# Altium schematic sheet mcu.SchDoc
size A3
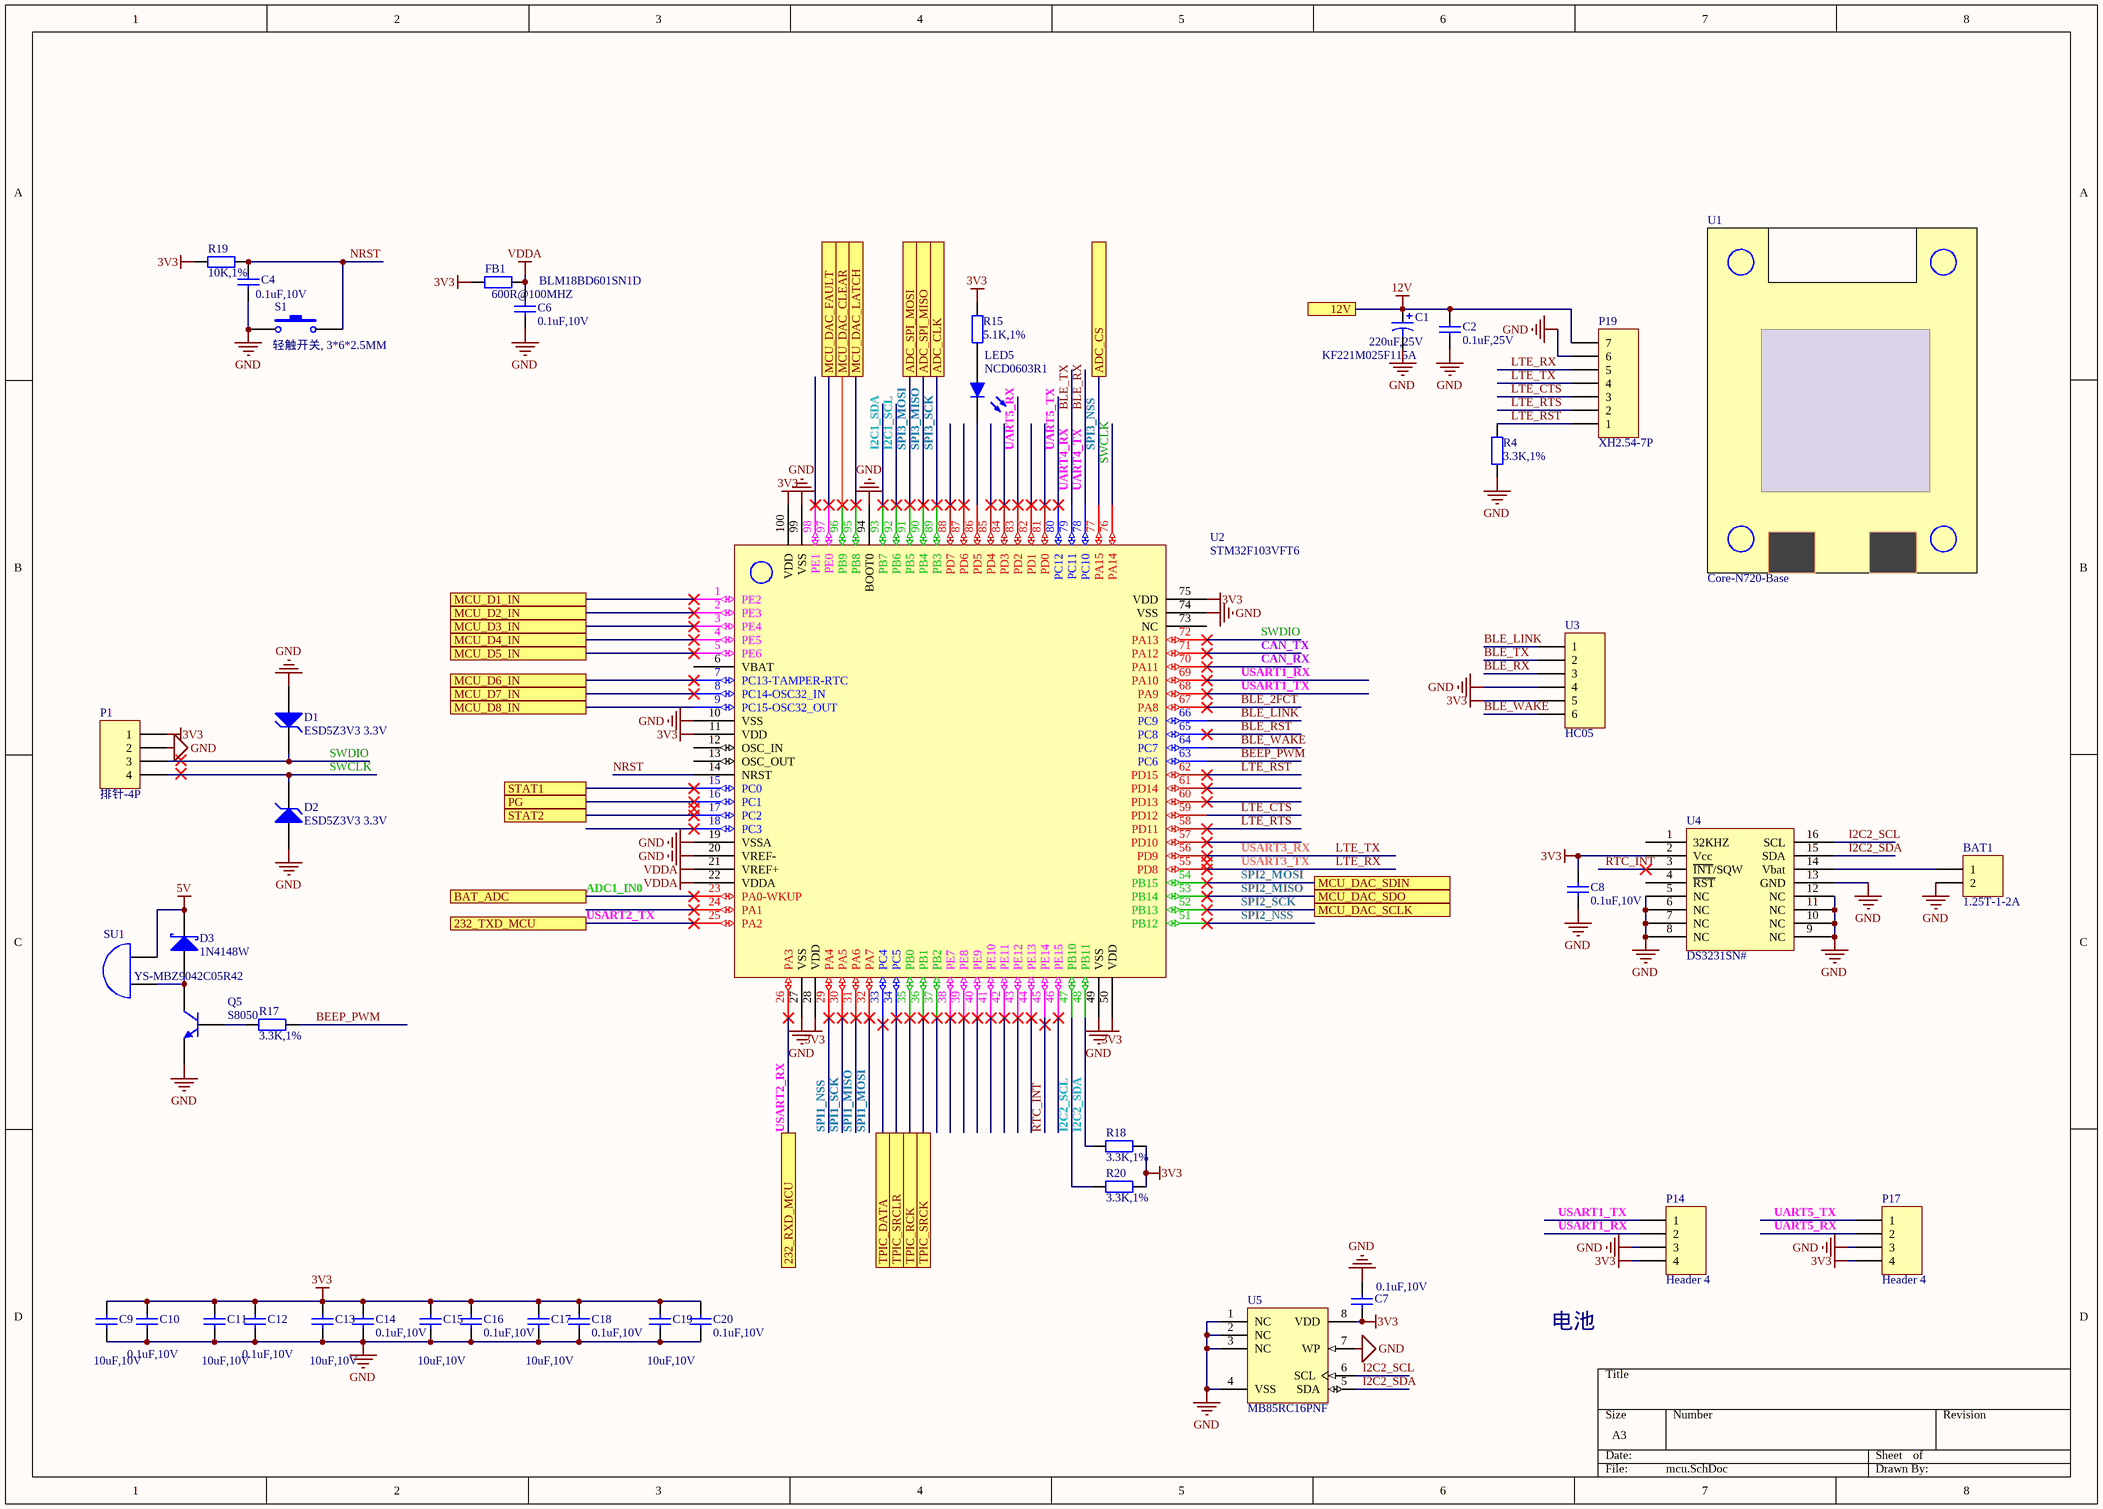
[diagram p0: mcu.SchDoc]

## Parts
BAT1  1.25T-1-2A  [1.25T-1-2A]
C1  220uF,25V  value KF221M025F115A  [CAP-TH_BD8.0-P3.50-D1.0-FD]
C2  0.1uF,25V  [C0603]
C4  0.1uF,10V  [C0603]
C6  0.1uF,10V  [C0603]
C7  0.1uF,10V  [C0603]
C8  0.1uF,10V  [C0603]
C9  10uF,10V  [C0603]
C10  0.1uF,10V  [C0603]
C11  10uF,10V  [C0603]
C12  0.1uF,10V  [C0603]
C13  10uF,10V  [C0603]
C14  0.1uF,10V  [C0603]
C15  10uF,10V  [C0603]
C16  0.1uF,10V  [C0603]
C17  10uF,10V  [C0603]
C18  0.1uF,10V  [C0603]
C19  10uF,10V  [C0603]
C20  0.1uF,10V  [C0603]
D1  ESD5Z3V3 3.3V  [SOD-523]
D2  ESD5Z3V3 3.3V  [SOD-523]
D3  1N4148W  [SOD-123_L2.8-W1.8-LS3.7-RD]
FB1  600R@100MHZ  value BLM18BD601SN1D  [L0603]
LED5  NCD0603R1  [LED0603-RD]
P1  排针-4P  [HDR1X4]
P14  Header 4  [HDR1X4]
P17  Header 4  [HDR1X4]
P19  XH2.54-7P  [XH2.54-7P-弯脚]
Q5  S8050  [SOT-23_NPN]
R4  3.3K,1%  [R0603]
R15  5.1K,1%  [R0603]
R17  3.3K,1%  [R0603]
R18  3.3K,1%  [R0603]
R19  10K,1%  [R0603]
R20  3.3K,1%  [R0603]
S1  轻触开关, 3*6*2.5MM  [3*6*2.5MM]
SU1  YS-MBZ9042C05R42  [BUZ-TH_BD9.0-P4.00-D1.0-FD]
U1  Core-N720-Base  [Core-N720-Base]
U2  STM32F103VFT6  [LQFP100_L]
U3  HC05  [HDR1X6]
U4  DS3231SN#  [SOIC-16_L10.3-W7.5-P1.27-LS10.3-BL]
U5  MB85RC16PNF  [8S1_N]

## Ports
12V, 232_RXD_MCU, 232_TXD_MCU, ADC_CLK, ADC_CS, ADC_SPI_MISO, ADC_SPI_MOSI, BAT_ADC, MCU_D1_IN, MCU_D2_IN, MCU_D3_IN, MCU_D4_IN, MCU_D5_IN, MCU_D6_IN, MCU_D7_IN, MCU_D8_IN, MCU_DAC_CLEAR, MCU_DAC_FAULT, MCU_DAC_LATCH, MCU_DAC_SCLK, MCU_DAC_SDIN, MCU_DAC_SDO, PG, STAT1, STAT2, TPIC_DATA, TPIC_RCK, TPIC_SRCK, TPIC_SRCLR

## Nets
3V3: C7.1 C8.2 C9.2 C10.2 C11.2 C12.2 C13.2 C14.2 C15.2 C16.2 C17.2 C18.2 C19.2 C20.2 FB1.1 P1.1 P14.4 P17.4 R15.2 R18.1 R19.1 R20.1 U2.11(VDD) U2.28(VDD) U2.50(VDD) U2.75(VDD) U2.100(VDD) U3.5 U4.2(Vcc) U5.8(VDD)
5V: D3.2(K) SU1.2(B)
12V: C1.1 C2.2 P19.7 ; port 12V
GND: BAT1.2 C1.2 C2.1 C4.1 C6.2 C7.2 C8.1 C9.1 C10.1 C11.1 C12.1 C13.1 C14.1 C15.1 C16.1 C17.1 C18.1 C19.1 C20.1 D1.1(A) D2.1(A) P1.2 P14.3 P17.3 P19.6 Q5.E R4.2 S1.1 U2.10(VSS) U2.19(VSSA) U2.20(VREF-) U2.27(VSS) U2.49(VSS) U2.74(VSS) U2.94(BOOT0) U2.99(VSS) U3.4 U4.5(NC) U4.6(NC) U4.7(NC) U4.8(NC) U4.9(NC) U4.10(NC) U4.11(NC) U4.12(NC) U4.13(GND) U5.1(NC) U5.2(NC) U5.3(NC) U5.4(VSS) U5.7(WP)
VDDA: C6.1 FB1.2 U2.21(VREF+) U2.22(VDDA)
ADC1_IN0: U2.23(PA0-WKUP) ; port BAT_ADC
BEEP_PWM: R17.2 U2.63(PC6)
BLE_2FCT: U2.67(PA8)
BLE_LINK: U2.66(PC9) U3.1
BLE_RST: U2.65(PC8)
BLE_RX: U2.78(PC10) U3.3  [also labelled UART4_TX]
BLE_TX: U2.79(PC11) U3.2  [also labelled UART4_RX]
BLE_WAKE: U2.64(PC7) U3.6
CAN_RX: U2.70(PA11)
CAN_TX: U2.71(PA12)
I2C1_SCL: U2.92(PB6)
I2C1_SDA: U2.93(PB7)
I2C2_SCL: R20.2 U2.47(PB10) U4.16(SCL) U5.6(SCL)
I2C2_SDA: R18.2 U2.48(PB11) U4.15(SDA) U5.5(SDA)
LTE_CTS: P19.3 U2.59(PD12)
LTE_RST: P19.1 R4.1 U2.62(PD15)
LTE_RTS: P19.2 U2.58(PD11)
LTE_RX: P19.5 U2.55(PD8)  [also labelled USART3_TX]
LTE_TX: P19.4 U2.56(PD9)  [also labelled USART3_RX]
MCU_D1_IN: U2.1(PE2) ; port MCU_D1_IN
MCU_D2_IN: U2.2(PE3) ; port MCU_D2_IN
MCU_D3_IN: U2.3(PE4) ; port MCU_D3_IN
MCU_D4_IN: U2.4(PE5) ; port MCU_D4_IN
MCU_D5_IN: U2.5(PE6) ; port MCU_D5_IN
MCU_D6_IN: U2.7(PC13-TAMPER-RTC) ; port MCU_D6_IN
MCU_D7_IN: U2.8(PC14-OSC32_IN) ; port MCU_D7_IN
MCU_D8_IN: U2.9(PC15-OSC32_OUT) ; port MCU_D8_IN
MCU_DAC_CLEAR: U2.96(PB9) ; port MCU_DAC_CLEAR
MCU_DAC_FAULT: U2.97(PE0) ; port MCU_DAC_FAULT
MCU_DAC_LATCH: U2.95(PB8) ; port MCU_DAC_LATCH
NRST: C4.2 R19.2 S1.2 U2.14(NRST)
PG: U2.16(PC1) ; port PG
RTC_INT: U2.45(PE14) U4.3(~{INT}/SQW)
SPI1_MISO: U2.31(PA6)
SPI1_MOSI: U2.32(PA7)
SPI1_NSS: U2.29(PA4)
SPI1_SCK: U2.30(PA5)
SPI2_MISO: U2.53(PB14) ; port MCU_DAC_SDO
SPI2_MOSI: U2.54(PB15) ; port MCU_DAC_SDIN
SPI2_NSS: U2.51(PB12)
SPI2_SCK: U2.52(PB13) ; port MCU_DAC_SCLK
SPI3_MISO: U2.90(PB4) ; port ADC_SPI_MISO
SPI3_MOSI: U2.91(PB5) ; port ADC_SPI_MOSI
SPI3_NSS: U2.77(PA15) ; port ADC_CS
SPI3_SCK: U2.89(PB3) ; port ADC_CLK
STAT1: U2.15(PC0) ; port STAT1
STAT2: U2.17(PC2) ; port STAT2
SWCLK: D2.2(K) P1.4 U2.76(PA14)
SWDIO: D1.2(K) P1.3 U2.72(PA13)
TPIC_DATA: U2.33(PC4) ; port TPIC_DATA
TPIC_RCK: U2.35(PB0) ; port TPIC_RCK
TPIC_SRCK: U2.36(PB1) ; port TPIC_SRCK
TPIC_SRCLR: U2.34(PC5) ; port TPIC_SRCLR
UART5_RX: P17.2 U2.83(PD2)
UART5_TX: P17.1 U2.80(PC12)
USART1_RX: P14.2 U2.69(PA10)
USART1_TX: P14.1 U2.68(PA9)
USART2_RX: U2.26(PA3) ; port 232_RXD_MCU
USART2_TX: U2.25(PA2) ; port 232_TXD_MCU
NetBAT1_1: BAT1.1 U4.14(Vbat)
NetD3_1: D3.1(A) Q5.C SU1.1(A)
NetLED5_1: LED5.1(K) U2.86(PD5)
NetLED5_2: LED5.2(A) R15.1
NetQ5_B: Q5.B R17.1

Not connected (* = marked no-connect by the designer): U2 6(VBAT) 12(OSC_IN) 13(OSC_OUT) 18(PC3)* 24(PA1)* 37(PB2)* 38(PE7)* 39(PE8)* 40(PE9)* 41(PE10)* 42(PE11)* 43(PE12)* 44(PE13)* 46(PE15)* 57(PD10)* 60(PD13)* 61(PD14)* 73(NC) 81(PD0)* 82(PD1)* 84(PD3)* 85(PD4)* 87(PD6)* 88(PD7)* 98(PE1)*; U4 1(32KHZ) 4(~{RST})

## Notes on the sheet
- 电池

## Library data of the parts
BAT1 = MHDR1X2: Header, 2-Pin; LatestRevisionDate: 17-Jul-2002; LatestRevisionNote: Re-released for DXP Platform.; Publisher: Altium Limited
C1 = Cap Pol1: Polarized Capacitor (Radial); Published: 8-Jun-2000; LatestRevisionDate: 17-Jul-2002; LatestRevisionNote: Re-released for DXP Platform.; PackageReference: RB7.6-15; Publisher: Altium Limited; PackageDescription: Polarized Capacitor (Radial); 2 Leads
C2 C4 C7-C20 = 无极电容: Value: 104, 16V; Type: 贴片电容
C6 = CAP: Capacitor; Fitted: True
D1 D2 = D Zener: Zener Diode; Published: 8-Jun-2000; LatestRevisionDate: 17-Jul-2002; LatestRevisionNote: Re-released for DXP Platform.; PackageReference: DIODE-0.7; Publisher: Altium Limited; PackageDescription: Diode, Thru-Hole; 2 Leads; 0.7 in Pin Spacing
D3 = D Schottky: Schottky Diode; Published: 8-Jun-2000; LatestRevisionDate: 17-Jul-2002; LatestRevisionNote: Re-released for DXP Platform.; PackageReference: SMB; Publisher: Altium Limited; PackageDescription: DO-214-AA/SMB; 2 C-Bend Leads; Body 5.3 x 3.6 mm, inc. leads (LxW); Code_JEDEC: DO-214-AA
FB1 = 电阻: Type: 贴片电阻
LED5 = LED0603: Typical INFRARED GaAs LED
P1 P14 P17 = Header 4: Header, 4-Pin; LatestRevisionDate: 17-Jul-2002; LatestRevisionNote: Re-released for DXP Platform.; Publisher: Altium Limited
P19 = Header 7: XH2.54弯脚座子
Q5 = S8050: NPN General Purpose Amplifier; Published: 8-Jun-2000; LatestRevisionDate: 15-Jan-2003; LatestRevisionNote: PCB Footprint 'BCY-W3/D4.7' replaced; DatasheetVersion: 1997; PackageVersion: Sep-1998; PackageReference: TO-92A; Publisher: Altium Limited; PackageDescription: TO, Flat Index; 3 In-Line, Axial Leads; Body Dia. 4.5mm; Leads 0.51 x 0.48 mm (max); ComponentLink1Description: Manufacturer Link; ComponentLink1URL: http://www.fairchildsemi.com/; ComponentLink2Description: Datasheet; ComponentLink2URL: http://www.fairchildsemi.com/ds/2N%2F2N3904.pdf
R4 R18 R20 = 电阻: Value: 10K; Type: 贴片电阻
R15 R19 = 电阻
  R15: Value: 5.1K, 1%; Type: 贴片电阻
R17 = 电阻: Value: 3.3K, 10%; Type: 贴片电阻
S1 = SW-PB: Switch; Published: 24-Mar-1999; LatestRevisionDate: 17-Jul-2002; LatestRevisionNote: Re-released for DXP Platform.; PackageReference: SPST-2; Publisher: Altium Limited; PackageDescription: Switch; 2 Leads
SU1 = Bell: Electrical Bell; Value: HY-5525; Published: 24-Mar-1999; LatestRevisionDate: 17-Jul-2002; LatestRevisionNote: Re-released for DXP Platform.; PackageReference: PIN2; Publisher: Altium Limited; Type: 贴片蜂鸣器
U1 = Core-N720-Base: Core-N720 核心板是由银尔达（yinerda）基于有方 N720 模组推出的高性能， / 小体积嵌入式 4G+GPS 定位核心版，硬件尺寸完全兼容本公司的 2G，Cat1,WIFI 核 / 心板， 最小成本的进项 2G、 4G 切换。 工作环境为-40℃-80℃， 支持 5-12V 供电， / Uart 做了电平转换， 可以直接与 3.3V MCU 使用串口进行通信， 预留 3.3V 高电平 / 复位管教， 方便异常恢复。 支持标准固件 AT 固件,支持功能电话语音、 短信、 / TCP&UDP、 、 NTP、 HTTP、 FTP、 MQTT、 直连阿里 IOT 云平台协议； 支持 GPS、 Beidou、 / GLONASS 定位功能。
U2 = STM32F103VX
U3 = Header 6: Header, 6-Pin; LatestRevisionDate: 17-Jul-2002; LatestRevisionNote: Re-released for DXP Platform.; Publisher: Altium Limited
U4 = DS3231SN#: 高精度、I2C接口、集成RTC/TCXO/晶体
U5 = MB85RC16V: name: 集成模块（SMD）